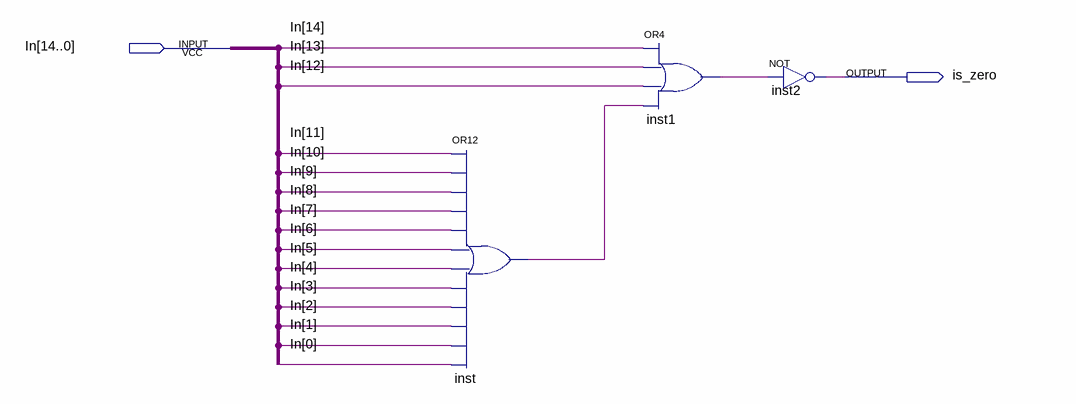
[diagram p0: schematic sheet]
// Quartus schematic check_zero.bdf as structural Verilog: 3 symbols, 2 pins
module check_zero (
  input  [14:0] In,
  output is_zero
);

  wire inst1_out, inst_out;

  or inst (inst_out, In[11], In[10], In[9], In[8], In[7], In[6], In[5], In[4], In[3], In[2], In[1], In[0]);
  or inst1 (inst1_out, In[14], In[13], In[12], inst_out);
  not inst2 (is_zero, inst1_out);
endmodule
